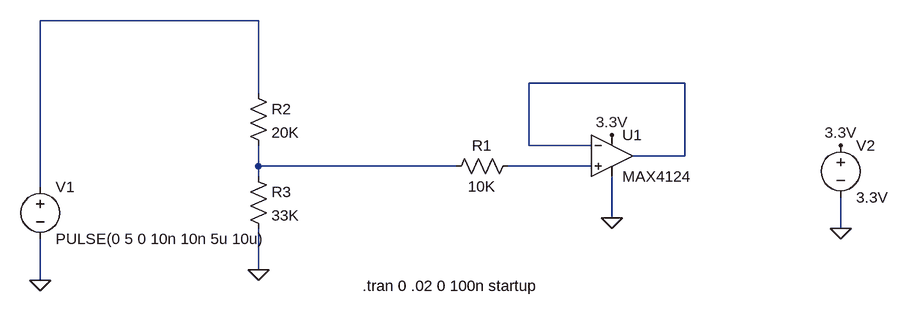
[diagram p0: schematic Hall_Sensor_Non-Inv_OpAmp.asc]
Hall_Sensor_Non-Inv_OpAmp.asc, the LTspice schematic file:
Version 4.1
SHEET 1 880 680
WIRE -368 -32 -704 -32
WIRE 288 64 48 64
WIRE -368 80 -368 -32
WIRE 48 160 48 64
WIRE 144 160 48 160
WIRE 288 176 288 64
WIRE 288 176 208 176
WIRE -368 192 -368 160
WIRE -64 192 -368 192
WIRE 144 192 16 192
WIRE -368 208 -368 192
WIRE -704 224 -704 -32
WIRE 176 272 176 208
WIRE 528 288 528 240
WIRE -368 352 -368 288
WIRE -704 368 -704 304
FLAG -704 368 0
FLAG 528 160 3.3V
FLAG 528 288 0
FLAG 176 144 3.3V
FLAG 176 272 0
FLAG -368 352 0
SYMBOL OpAmps\\MAX4124 176 112 R0
SYMATTR InstName U1
SYMBOL res 32 176 R90
WINDOW 0 0 56 VBottom 2
WINDOW 3 32 56 VTop 2
SYMATTR InstName R1
SYMATTR Value 10K
SYMBOL voltage -704 208 R0
WINDOW 123 0 0 Left 0
WINDOW 39 0 0 Left 0
SYMATTR InstName V1
SYMATTR Value PULSE(0 5 0 10n 10n 5u 10u)
SYMBOL voltage 528 144 R0
WINDOW 123 0 0 Left 0
WINDOW 39 0 0 Left 0
SYMATTR InstName V2
SYMATTR Value 3.3V
SYMBOL res -384 64 R0
SYMATTR InstName R2
SYMATTR Value 20K
SYMBOL res -384 192 R0
SYMATTR InstName R3
SYMATTR Value 33K
TEXT -208 376 Left 2 !.tran 0 .02 0 100n startup

The netlist it stands for:
* Hall_Sensor_Non-Inv_OpAmp.asc
X§U1 N004 N002 3.3V 0 N002 MAX4124  ; pins In+ In- V+ V- OUT
R1 N004 N003 10K
V1 N001 0 PULSE(0 5 0 10n 10n 5u 10u)
V2 3.3V 0 3.3V
R2 N001 N003 20K
R3 N003 0 33K
.tran 0 .02 0 100n startup
.backanno
.end